# EAGLE schematic start stop (EAGLE 9.4.0)
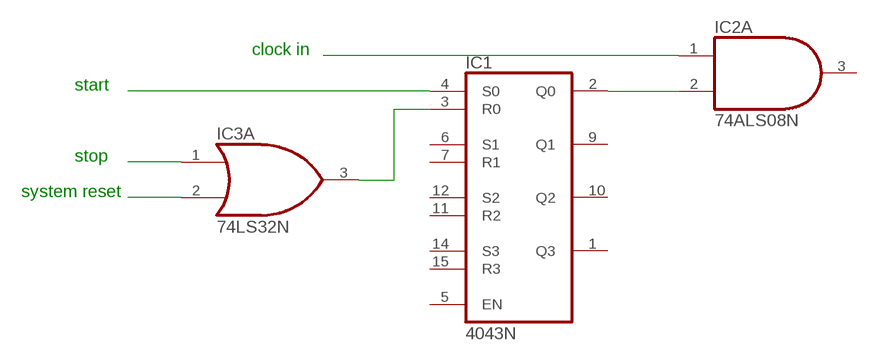
[diagram p0: schematic, sheet 1]

## Parts
IC1  4043N  [DIL16]
IC2  74ALS08N  [DIL14]
IC3  74LS32N  [DIL14]

## Nets
N$1: IC1.2(Q0) IC2.2(A:I1)
N$2: IC2.1(A:I0)
N$3: IC3.1(A:I0)
N$4: IC3.2(A:I1)
N$5: IC1.3(R0) IC3.3(A:O)
N$6: IC1.4(S0)
Unconnected: IC1.1(Q3) IC1.5(EN) IC1.6(S1) IC1.7(R1) IC1.9(Q1) IC1.10(Q2) IC1.11(R2) IC1.12(S2) IC1.14(S3) IC1.15(R3) IC2.3(A:O) IC2.4(B:I0) IC2.5(B:I1) IC2.6(B:O) IC2.8(C:O) IC2.9(C:I0) IC2.10(C:I1) IC2.11(D:O) IC2.12(D:I0) IC2.13(D:I1) IC3.4(B:I0) IC3.5(B:I1) IC3.6(B:O) IC3.8(C:O) IC3.9(C:I0) IC3.10(C:I1) IC3.11(D:O) IC3.12(D:I0) IC3.13(D:I1)

## Notes on the sheet
- clock in
- start
- stop
- system reset

## Power pins joined to a net without a drawn wire
GND: IC2.7(P:GND) IC3.7(P:GND)
VCC: IC2.14(P:VCC) IC3.14(P:VCC)
VDD: IC1.16(VDD)
VSS: IC1.8(VSS)

## Library data of the parts
IC1 = 40xx:4043: Quad 3-state NOR R/S LATCH
IC2 = 74xx-us:74*08: Quad 2-input AND gate
IC3 = 74xx-us:74*32: Quad 2-input OR gate